# EAGLE design Shield_Schematic (EAGLE 9.4.2)
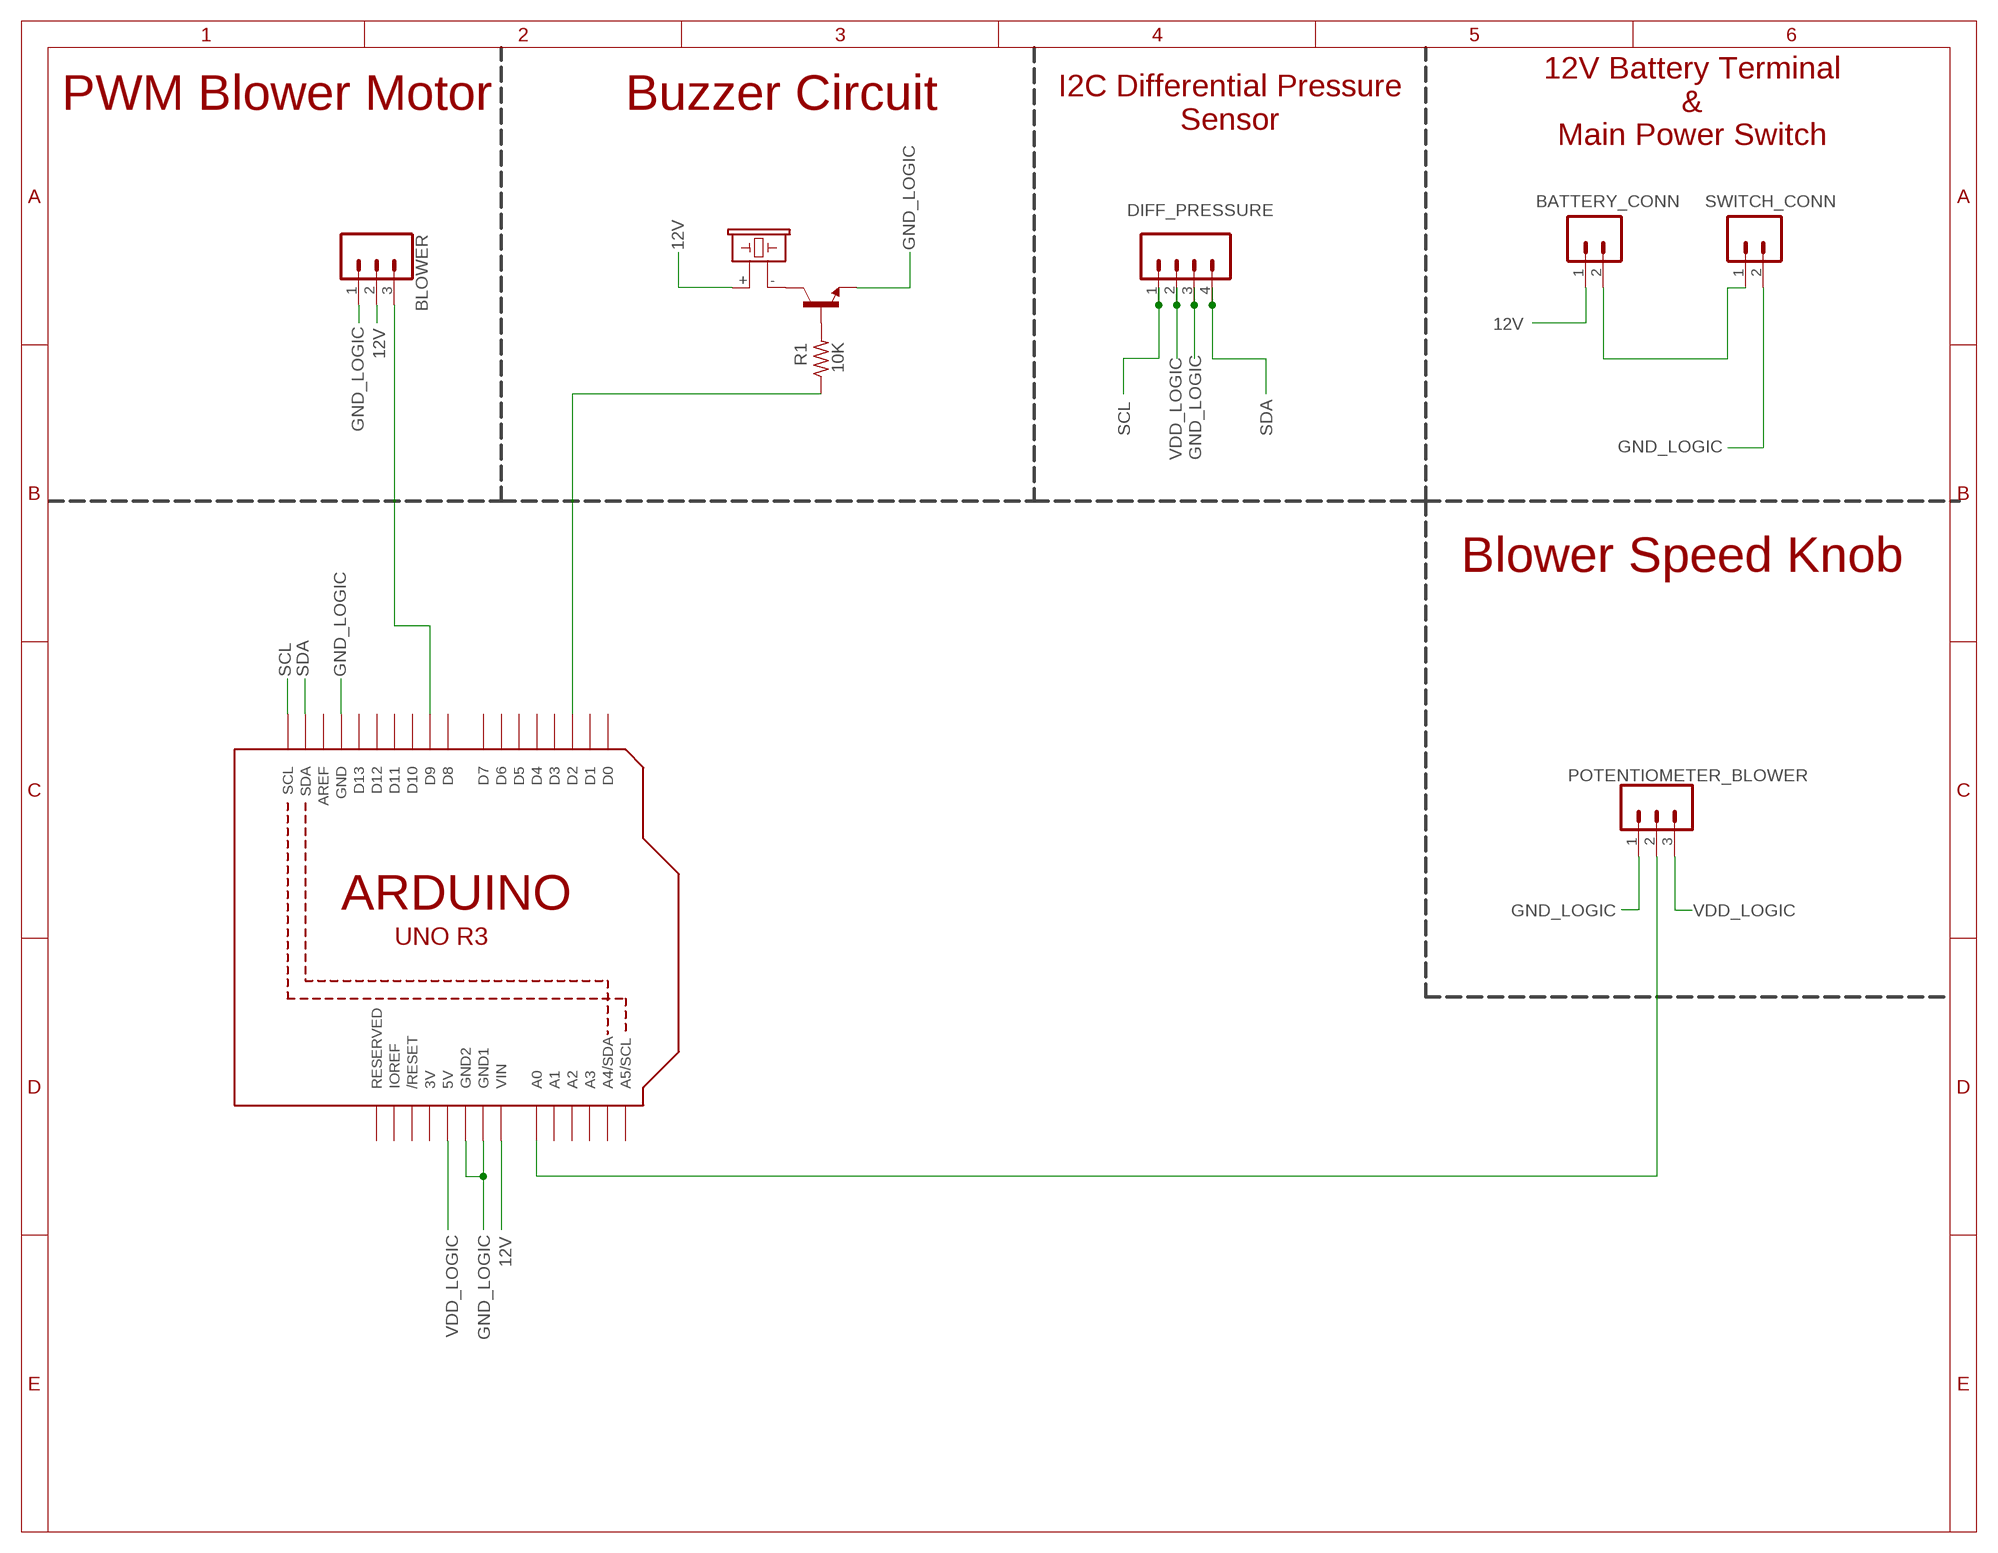
[diagram p0: schematic, sheet 1]

## Parts
BATTERY_CONN  CONN_02PTH4  [1X02_XTRA_BIG]
BLOWER  CONN_03  [1X03]
DIFF_PRESSURE  CONN_04  [1X04]
POTENTIOMETER_BLOWER  CONN_03  [1X03]
R1  10K  R-US_0817/7V  [P0817V]
SG1  F/CM12P  [F/CM12P]
SWITCH_CONN  CONN_02PTH4  [1X02_XTRA_BIG]
T1  2N5089  [TO92]
U1  ARDUINOR3-DIMENSION  [ARDUINOR3]

## Nets
12V: BATTERY_CONN.1 BLOWER.2 SG1.+ U1.VIN
GND_LOGIC: BLOWER.1 DIFF_PRESSURE.3 POTENTIOMETER_BLOWER.1 SWITCH_CONN.2 T1.3(E) U1.GND U1.GND1 U1.GND2
N$1: POTENTIOMETER_BLOWER.2 U1.A0
N$2: BLOWER.3 U1.D9
N$3: R1.1 U1.D2
N$4: R1.2 T1.2(B)
N$5: SG1.- T1.1(C)
N$6: BATTERY_CONN.2 SWITCH_CONN.1
SCL: DIFF_PRESSURE.1 U1.SCL
SDA: DIFF_PRESSURE.4 U1.SDA
VDD_LOGIC: DIFF_PRESSURE.2 POTENTIOMETER_BLOWER.3 U1.5V
Unconnected: U1.A1 U1.A2 U1.A3 U1.A4(A4/SDA) U1.A5(A5/SCL) U1.AREF U1.D0 U1.D1 U1.D3 U1.D4 U1.D5 U1.D6 U1.D7 U1.D8 U1.D10 U1.D11 U1.D12 U1.D13 U1.IOREF U1.RESERVED U1.RESET(/RESET)

## Notes on the sheet
- 12V Battery Terminal
  &
  Main Power Switch
- I2C Differential Pressure
  Sensor
- PWM Blower Motor | Buzzer Circuit
- Blower Speed Knob

## Power pins joined to a net without a drawn wire
3V: U1.3V

## Library data of the parts
BATTERY_CONN SWITCH_CONN = SparkFun-Connectors:CONN_02: Multi connection point. Often used as Generic Header-pin footprint for 0.1 inch spaced/style header connections On any of the 0.1 inch spaced packages, you can populate with these: Break Away Headers - Straight <https://www.sparkfun.com/products/116> (PRT-00116) Break Away Male Headers - Right Angle <https://www.sparkfun.com/products/553> (PRT-00553) Female Headers <https://www.sparkfun.com/products/115> (PRT-00115) Break Away Headers - Machine Pin <https://www.sparkfun.com/products/117> (PRT-00117) Break Away Female Headers - Swiss Machine Pin <https://www.sparkfun.com/products/743> (PRT-00743) For SCREWTERMINALS and SPRING TERMINALS visit here: Screw Terimnals on SparkFun.com <https://www.sparkfun.com/search/results?term=Screw+Terminals> (5mm/3.5mm/2.54mm spacing) This device is also useful as a general connection point to wire up your design to another part of your project. Our various solder wires solder well into these plated through hole pads. Hook-Up Wire - Assortment (Stranded, 22 AWG) <https://www.sparkfun.com/products/11375> (PRT-11375) Hook-Up Wire - Assortment (Solid Core, 22 AWG) <https://www.sparkfun.com/products/11367> (PRT-11367) View the entire wire category on our website here <https://www.sparkfun.com/categories/141> Special notes: Molex polarized connector foot print use with: PRT-08233 with associated crimp pins and housings. 2.54_SCREWTERM for use with PRT-10571. 3.5mm Screw Terminal footprints for PRT-08084 5mm Screw Terminal footprints for use with PRT-08432
BLOWER POTENTIOMETER_BLOWER = SparkFun-Connectors:CONN_03: Multi connection point. Often used as Generic Header-pin footprint for 0.1 inch spaced/style header connections On any of the 0.1 inch spaced packages, you can populate with these: Break Away Headers - Straight <https://www.sparkfun.com/products/116> (PRT-00116) Break Away Male Headers - Right Angle <https://www.sparkfun.com/products/553> (PRT-00553) Female Headers <https://www.sparkfun.com/products/115> (PRT-00115) Break Away Headers - Machine Pin <https://www.sparkfun.com/products/117> (PRT-00117) Break Away Female Headers - Swiss Machine Pin <https://www.sparkfun.com/products/743> (PRT-00743) Stackable Header - 3 Pin (Female, 0.1") <https://www.sparkfun.com/products/13875> (PRT-13875) For SCREWTERMINALS and SPRING TERMINALS visit here: Screw Terimnals on SparkFun.com <https://www.sparkfun.com/search/results?term=Screw+Terminals> (5mm/3.5mm/2.54mm spacing) This device is also useful as a general connection point to wire up your design to another part of your project. Our various solder wires solder well into these plated through hole pads. Hook-Up Wire - Assortment (Stranded, 22 AWG) <https://www.sparkfun.com/products/11375> (PRT-11375) Hook-Up Wire - Assortment (Solid Core, 22 AWG) <https://www.sparkfun.com/products/11367> (PRT-11367) View the entire wire category on our website here <https://www.sparkfun.com/categories/141> Special notes: Molex polarized connector foot print use with SKU : PRT-08232 with associated crimp pins and housings.
DIFF_PRESSURE = SparkFun-Connectors:CONN_04: Multi connection point. Often used as Generic Header-pin footprint for 0.1 inch spaced/style header connections On any of the 0.1 inch spaced packages, you can populate with these: Break Away Headers - Straight <https://www.sparkfun.com/products/116> (PRT-00116) Break Away Male Headers - Right Angle <https://www.sparkfun.com/products/553> (PRT-00553) Female Headers <https://www.sparkfun.com/products/115> (PRT-00115) Break Away Headers - Machine Pin <https://www.sparkfun.com/products/117> (PRT-00117) Break Away Female Headers - Swiss Machine Pin <https://www.sparkfun.com/products/743> (PRT-00743) For SCREWTERMINALS and SPRING TERMINALS visit here: Screw Terimnals on SparkFun.com <https://www.sparkfun.com/search/results?term=Screw+Terminals> (5mm/3.5mm/2.54mm spacing) This device is also useful as a general connection point to wire up your design to another part of your project. Our various solder wires solder well into these plated through hole pads. Hook-Up Wire - Assortment (Stranded, 22 AWG) <https://www.sparkfun.com/products/11375> (PRT-11375) Hook-Up Wire - Assortment (Solid Core, 22 AWG) <https://www.sparkfun.com/products/11367> (PRT-11367) View the entire wire category on our website here <https://www.sparkfun.com/categories/141> Special notes: Molex polarized connector foot print use with SKU : PRT-08231 with associated crimp pins and housings. 1MM SMD Version SKU: PRT-10208; PROD_ID: CONN-09696
R1 = rcl:R-US_: RESISTOR, American symbol; SPICEPREFIX: R
SG1 = buzzer:F/CM12P: BUZZER Source: Buerklin; OC_FARNELL: unknown; OC_NEWARK: unknown
T1 = transistor:2N5089: NPN TRANSISTOR
U1 = adafruit:ARDUINOR3: This is a new object for the new Arduino R3 - with extra pins that you may want to use (such as IOref, and duplicated A4/A5

## Board
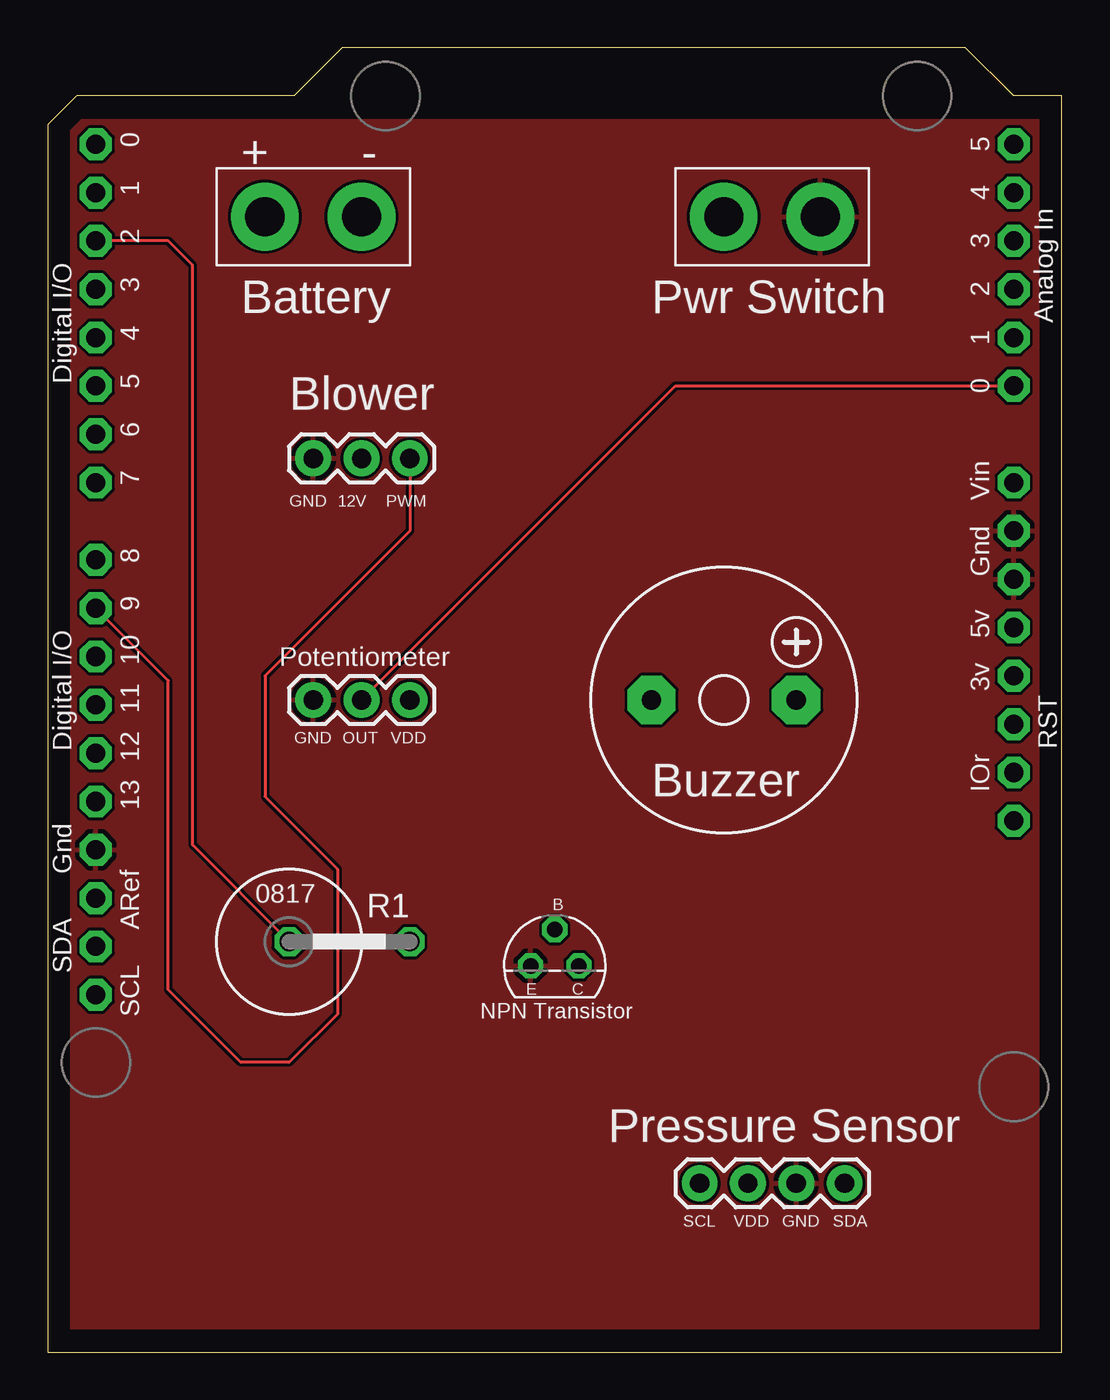
[diagram p1: board, top side]
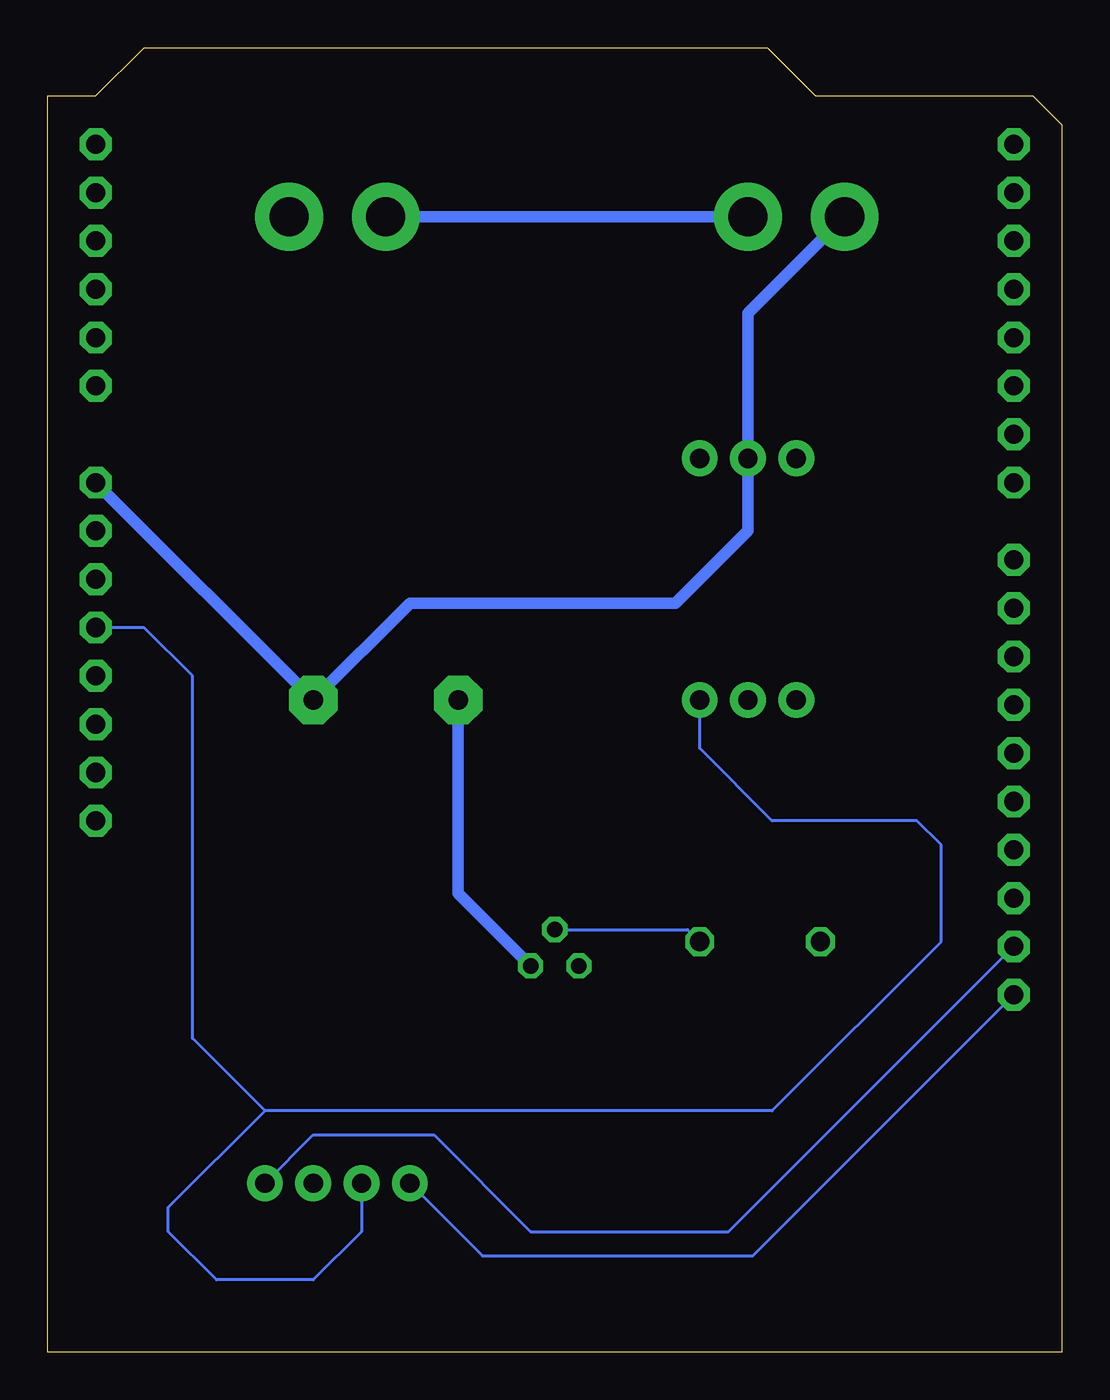
[diagram p2: board, bottom side, seen from below]

Size 53.34 x 68.58 mm. Coordinates in mm from the lower left corner, seen from the top.
Copper layers (1*16): Top 0.035mm / dielectric 1.5mm / Bottom 0.035mm
Design rules "default": minimum track width 6mil, minimum drill 0.35mm, track to track 6mil, track to pad 6mil, pad to pad 6mil, via to via 6mil, smd to smd 6mil, copper to edge 40mil, drill to drill 6mil, minimum pad ring 10mil, minimum via ring 8mil, stop-mask expansion 4mil, vias tented up to drill 0mil, thermal gap 10mil

### Footprints (pad centres in the part's own frame; a part is rotated, then mirrored left to right if it is on the bottom)
1X02_XTRA_BIG = drill 2.057 pad 3.556: 1 -2.54,0; 2 2.54,0
1X03 = drill 1.016 pad 1.88: 1 0,0; 2 2.54,0; 3 5.08,0
1X04 = drill 1.016 pad 1.88: 1 0,0; 2 2.54,0; 3 5.08,0; 4 7.62,0
P0817V = drill 1.016 octagon: 1 -5.08,0; 2 1.27,0
F/CM12P = drill 1.016 pad 2.54 octagon: + 3.81,0; - -3.81,0
TO92 = drill 0.813 octagon: 1 1.27,0; 2 0,1.905; 3 -1.27,0
ARDUINOR3 = drill 1 pad 1.676 octagon: 3V 35.56,2.54; 5V 38.1,2.54; A0 50.8,2.54; A1 53.34,2.54; A2 55.88,2.54; A3 58.42,2.54; A4 60.96,2.54; A5 63.5,2.54; AREF 23.876,50.8; D0 63.5,50.8; D1 60.96,50.8; D2 58.42,50.8; D3 55.88,50.8; D4 53.34,50.8; D5 50.8,50.8; D6 48.26,50.8; D7 45.72,50.8; D8 41.656,50.8; D9 39.116,50.8; D10 36.576,50.8; D11 34.036,50.8; D12 31.496,50.8; D13 28.956,50.8; GND 26.416,50.8; GND1 43.18,2.54; GND2 40.64,2.54; IOREF 30.48,2.54; RESERVED 27.94,2.54; RESET 33.02,2.54; SCL 18.796,50.8; SDA 21.336,50.8; VIN 45.72,2.54

### Placement (x,y rotation side)
BATTERY_CONN  13.97,59.69 0 top
BLOWER  13.97,46.99 0 top
DIFF_PRESSURE  34.29,8.89 0 top
POTENTIOMETER_BLOWER  13.97,34.29 0 top
R1  17.78,21.59 0 top
SG1  35.56,34.29 0 top
SWITCH_CONN  38.1,59.69 0 top
T1  26.67,20.32 0 top
U1  53.34,0 90 top

### Tracks (layer width: path | path; a pad name or v marks a point on that pad's centre or on a via)
12V
  Bottom 0.61: U1.VIN SG1.+ 34.29,39.37 20.32,39.37 16.51,43.18 BLOWER.2 16.51,54.61 BATTERY_CONN.1
GND_LOGIC
  pour Top: 1.27,64.77 52.07,64.77 52.07,1.27 1.27,1.27
N$1
  Top 0.152: POTENTIOMETER_BLOWER.2 33.02,50.8 U1.A0
N$2
  Top 0.152: BLOWER.3 19.05,43.18 11.43,35.56 11.43,29.21 15.24,25.4 15.24,17.78 12.7,15.24 10.16,15.24 6.35,19.05 6.35,35.31 U1.D9
N$3
  Top 0.152: R1.1 7.62,26.67 7.62,57.15 6.35,58.42 U1.D2
N$4
  Bottom 0.152: T1.2 19.68,22.23 R1.2
N$5
  Bottom 0.61: SG1.- 31.75,24.13 T1.1
N$6
  Bottom 0.61: BATTERY_CONN.2 SWITCH_CONN.1
SCL
  Bottom 0.152: DIFF_PRESSURE.1 30.48,5.08 16.26,5.08 U1.SCL
SDA
  Bottom 0.152: DIFF_PRESSURE.4 39.37,11.43 33.02,11.43 27.94,6.35 17.53,6.35 U1.SDA
VDD_LOGIC
  Bottom 0.152: DIFF_PRESSURE.2 36.83,6.35 39.37,3.81 44.45,3.81 46.99,6.35 46.99,7.62 41.91,12.7 | POTENTIOMETER_BLOWER.3 19.05,31.75 15.24,27.94 7.62,27.94 6.35,26.67 6.35,21.59 15.24,12.7 41.91,12.7 | 41.91,12.7 45.72,16.51 45.72,35.56 48.26,38.1 U1.5V

### Text on the board
tPlace: + | - | Battery | Pwr Switch | Blower | GND | 12V | PWM | Potentiometer | GND | OUT | VDD | Buzzer | B | E | C | NPN Transistor | Pressure Sensor | SCL | VDD | GND | SDA